# EasyEDA schematic EasyEDA_ATTinyX5_Programmer_V1_Schematic.json
TITLE: ATTinyX5 DIP-8 Programmer; REV: 1.0; Date: 2020-08-23; Sheet: 1/1; Drawn By: Devin Watson
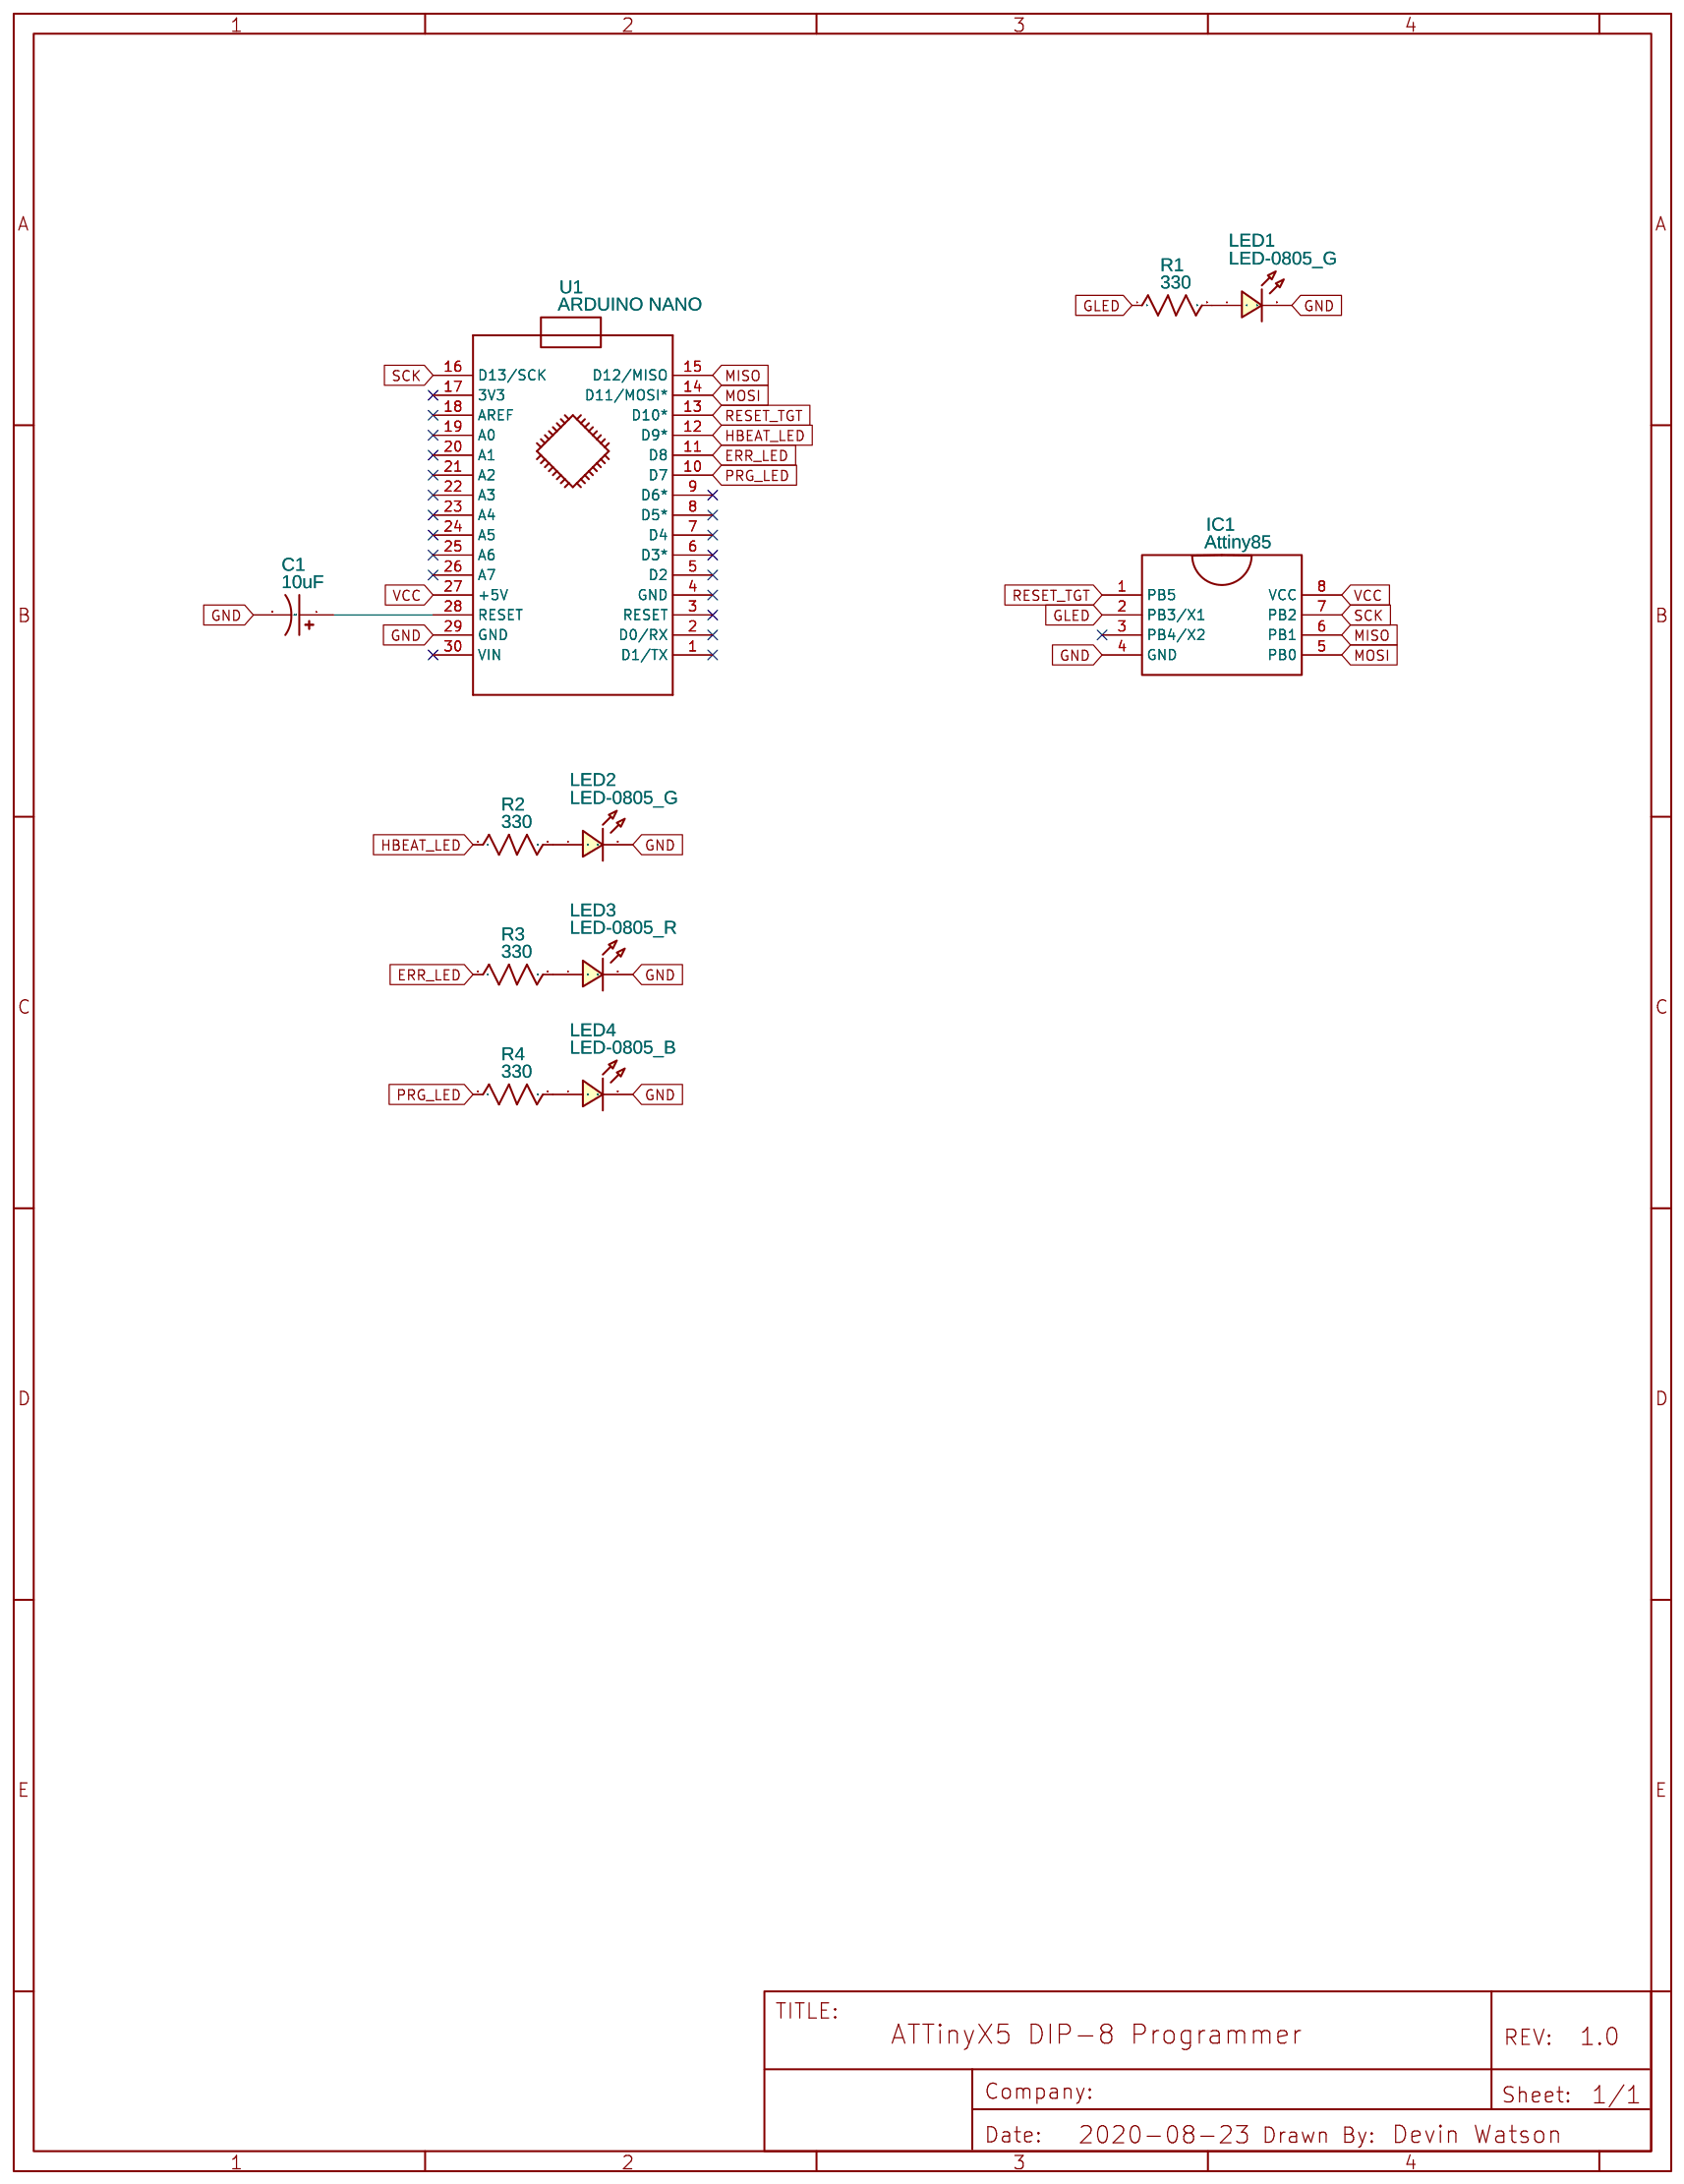
[diagram p0: schematic sheet]

## Parts
C1  10uF  [CAP-D4.0×H5.5]
IC1  Attiny85  [DIP8]
LED1  LED-0805_G  [LED0805_GREEN]
LED2  LED-0805_G  [LED0805_GREEN]
LED3  LED-0805_R  [LED0805_RED]
LED4  LED-0805_B  [LED0805_BLUE]
R1  330  [R0805]
R2  330  [R0805]
R3  330  [R0805]
R4  330  [R0805]
U1  ARDUINO NANO  [ARDUINO_NANO]

## Library data of the parts
C1 = CE_SMD_D4.0×H5.5_US: Supplier Part: 667-EEE-HP0J100R; Supplier: Mouser; Contributor: LCEDA_Lib; Manufacturer Part: EEE-HP0J100R; Manufacturer: Panasonic
IC1 = Attiny85: Contributor: Nuros
LED1 LED2 = LED-0805_G: Manufacturer: Everlight; Manufacturer Part: 17-21SYGC/S530-E2/TR8; Supplier Part: 638-1721SYGCS530E2; Supplier: Mouser; Contributor: LCEDA_Lib
LED3 = LED-0805_R: Manufacturer: EVERLIGHT(台湾亿光); Manufacturer Part: EL-12-215SURC/S530-A2/TR8; Supplier Part: 638-215SURCS530A28; Supplier: Mouser; Contributor: LCEDA_Lib
LED4 = LED-0805_B: Manufacturer: Lite-On; Manufacturer Part: LTST-C170TBKT; Supplier Part: 859-LTST-C170TBKT; Supplier: Mouser; Contributor: LCEDA_Lib
R1-R4 = R_0805_US: Supplier Part: 71-CRCW0805330RJNEAC; Supplier: Mouser; Contributor: LCEDA_Lib; Manufacturer Part: CRCW0805330RJNEAC; Manufacturer: Vishay/Dale
U1 = -: sourceId: KGSeAWhDB; Manufacturer Part: ?

## Nets
GND: C1.2 IC1.4(GND) LED1.2 LED2.2 LED3.2 LED4.2 U1.29(GND)
VCC: IC1.8(VCC) U1.27(+5V)
ERR_LED: R3.1 U1.11(D8)
GLED: IC1.2(PB3/X1) R1.1
HBEAT_LED: R2.1 U1.12(D9*)
MISO: IC1.6(PB1) U1.15(D12/MISO)
MOSI: IC1.5(PB0) U1.14(D11/MOSI*)
PRG_LED: R4.1 U1.10(D7)
RESET_TGT: IC1.1(PB5) U1.13(D10*)
SCK: IC1.7(PB2) U1.16(D13/SCK)
Net-(C1-1): C1.1 U1.28(RESET)
Net-(LED1-1): LED1.1 R1.2
Net-(LED2-1): LED2.1 R2.2
Net-(LED3-1): LED3.1 R3.2
Net-(LED4-1): LED4.1 R4.2

Not connected (* = marked no-connect by the designer): IC1 3(PB4/X2)*; U1 1(D1/TX)* 2(D0/RX)* 3(RESET)* 4(GND)* 5(D2)* 6(D3*)* 7(D4)* 8(D5*)* 9(D6*)* 17(3V3)* 18(AREF)* 19(A0)* 20(A1)* 21(A2)* 22(A3)* 23(A4)* 24(A5)* 25(A6)* 26(A7)* 30(VIN)*
